# EAGLE design rpi-shield (EAGLE 9.2.2)
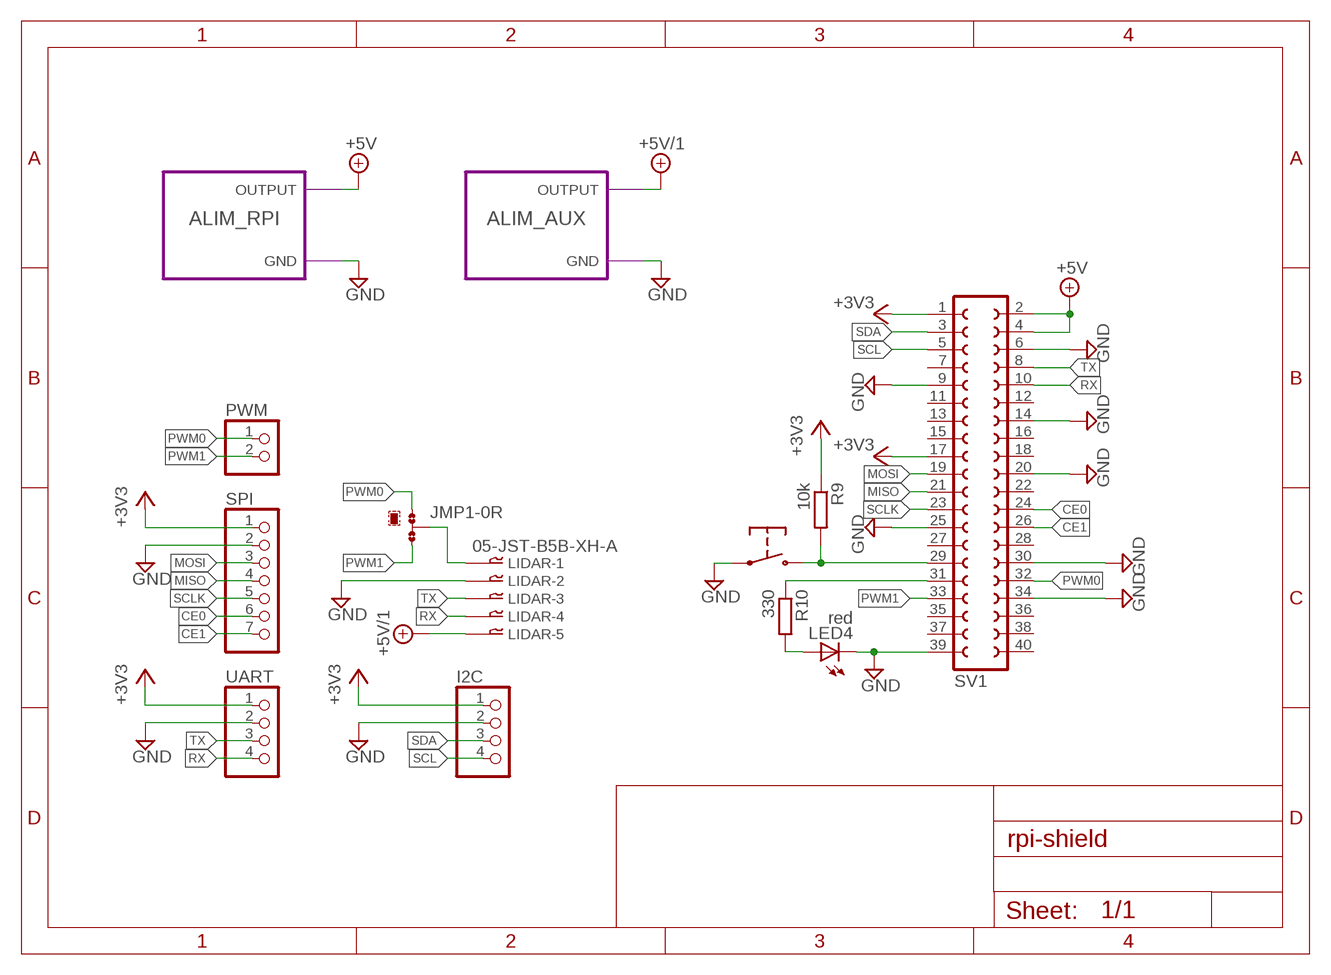
[diagram p0: schematic, sheet 1]

## Parts
I2C  PINHD-1X4  [1X04]
JMP1  0R-JUMPA  [A0R-JMP]
LED4  red  LEDSMT1206  [1206]
LIDAR  05-JST-B5B-XH-A  [B5B-XH]
PWM  PINHD-1X2  [1X02]
R9  10k  R-EU_R0805  [R0805]
R10  330  R-EU_R0805  [R0805]
SPI  PINHD-1X7  [1X07]
SV1  FE20-2  [FE20-2]
U$2  PUSH-BUTTON  [PUSH-BUTTON]
UART  PINHD-1X4  [1X04]

## Module instances
ALIM_RPI = 5V_ALIM
ALIM_AUX = 5V_ALIM

## Nets
+3V3: I2C.1 R9.1 SPI.1 SV1.1 SV1.17 UART.1
+5V: SV1.2 SV1.4 ; port ALIM_RPI.OUTPUT
+5V/1: LIDAR.P$5 ; port ALIM_AUX.OUTPUT
CE0: SPI.6 SV1.24
CE1: SPI.7 SV1.26
GND: I2C.2 LED4.C LIDAR.P$2 SPI.2 SV1.6 SV1.9 SV1.14 SV1.20 SV1.25 SV1.30 SV1.34 SV1.39 U$2.1 U$2.2 UART.2 ; port ALIM_RPI.GND ALIM_AUX.GND
MISO: SPI.4 SV1.21
MOSI: SPI.3 SV1.19
N$1: JMP1.2 LIDAR.P$1
N$2: R9.2 SV1.29 U$2.3 U$2.4
N$5: R10.1 SV1.31
N$11: LED4.A R10.2
PWM0: JMP1.1 PWM.1 SV1.32
PWM1: JMP1.3 PWM.2 SV1.33
RX: LIDAR.P$4 SV1.10 UART.4
SCL: I2C.4 SV1.5
SCLK: SPI.5 SV1.23
SDA: I2C.3 SV1.3
TX: LIDAR.P$3 SV1.8 UART.3
Unconnected: SV1.7 SV1.11 SV1.12 SV1.13 SV1.15 SV1.16 SV1.18 SV1.22 SV1.27 SV1.28 SV1.35 SV1.36 SV1.37 SV1.38 SV1.40

## Library data of the parts
I2C UART = pinhead:PINHD-1X4: PIN HEADER
JMP1 = jump-0r-smd:0R-JUMP: SMD 0R 0805 Jumper
LED4 = led:LED: LED OSRAM: - CHIPLED LG R971, LG N971, LY N971, LG Q971, LY Q971, LO R971, LY R971 LH N974, LH R974 LS Q976, LO Q976, LY Q976 LO Q996 - Hyper CHIPLED LW Q18S LB Q993, LB Q99A, LB R99A - SideLED LS A670, LO A670, LY A670, LG A670, LP A670 LB A673, LV A673, LT A673, LW A673 LH A674 LY A675 LS A676, LA A676, LO A676, LY A676, LW A676 LS A679, LY A679, LG A679 - Hyper Micro SIDELED® LS Y876, LA Y876, LO Y876, LY Y876 LT Y87S - SmartLED LW L88C, LW L88S LB L89C, LB L89S, LG L890 LS L89K, LO L89K, LY L89K LS L896, LA L896, LO L896, LY L896 - TOPLED LS T670, LO T670, LY T670, LG T670, LP T670 LSG T670, LSP T670, LSY T670, LOP T670, LYG T670 LG T671, LOG T671, LSG T671 LB T673, LV T673, LT T673, LW T673 LH T674 LS T676, LA T676, LO T676, LY T676, LB T676, LH T676, LSB T676, LW T676 LB T67C, LV T67C, LT T67C, LS T67K, LO T67K, LY T67K, LW E67C LS E67B, LA E67B, LO E67B, LY E67B, LB E67C, LV E67C, LT E67C LW T67C LS T679, LY T679, LG T679 LS T770, LO T770, LY T770, LG T770, LP T770 LB T773, LV T773, LT T773, LW T773 LH T774 LS E675, LA E675, LY E675, LS T675 LS T776, LA T776, LO T776, LY T776, LB T776 LHGB T686 LT T68C, LB T68C - Hyper Mini TOPLED® LB M676 - Mini TOPLED Santana® LG M470 LS M47K, LO M47K, LY M47K Source: http://www.osram.convergy.de LUXEON: - LUMILED® LXK2-PW12-R00, LXK2-PW12-S00, LXK2-PW14-U00, LXK2-PW14-V00 LXK2-PM12-R00, LXK2-PM12-S00, LXK2-PM14-U00 LXK2-PE12-Q00, LXK2-PE12-R00, LXK2-PE12-S00, LXK2-PE14-T00, LXK2-PE14-U00 LXK2-PB12-K00, LXK2-PB12-L00, LXK2-PB12-M00, LXK2-PB14-N00, LXK2-PB14-P00, LXK2-PB14-Q00 LXK2-PR12-L00, LXK2-PR12-M00, LXK2-PR14-Q00, LXK2-PR14-R00 LXK2-PD12-Q00, LXK2-PD12-R00, LXK2-PD12-S00 LXK2-PH12-R00, LXK2-PH12-S00 LXK2-PL12-P00, LXK2-PL12-Q00, LXK2-PL12-R00 Source: www.luxeon.com KINGBRIGHT: KA-3528ASYC Source: www.kingbright.com
LIDAR = bt_con-jst-xh:05-JST: JST CONNECTOR
PWM = pinhead:PINHD-1X2: PIN HEADER
R9 R10 = resistor:R-EU_: RESISTOR, European symbol
SPI = pinhead:PINHD-1X7: PIN HEADER
SV1 = con-lsta:FE20-2: FEMALE HEADER; OC_FARNELL: unknown; OC_NEWARK: unknown
U$2 = push-button:PUSH-BUTTON; RS: 479-1491

## Module 5V_ALIM
Ports: OUTPUT(io) GND(io)
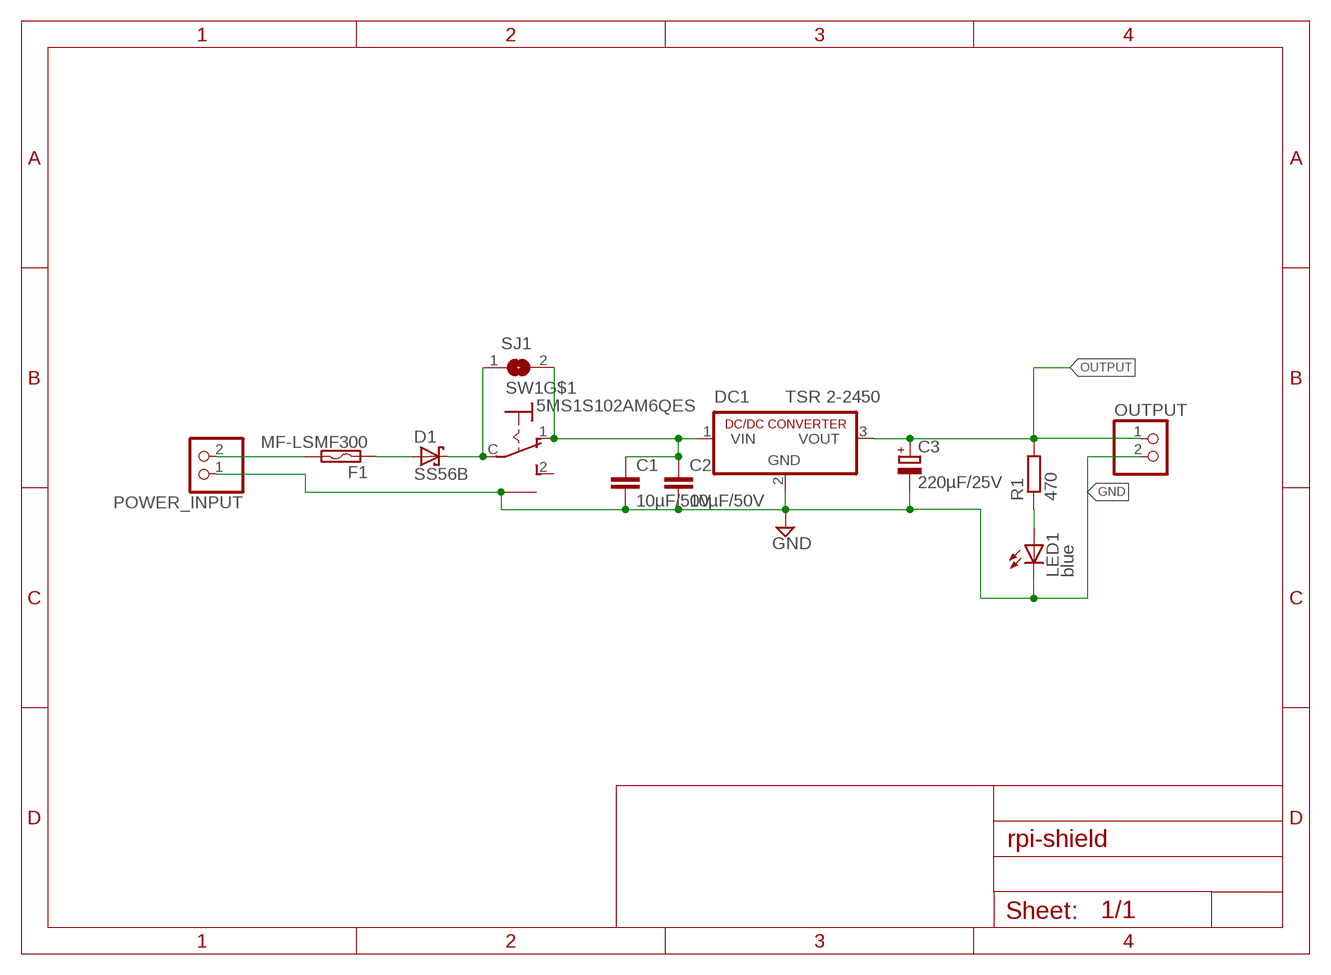
[diagram p1: schematic, module 5V_ALIM, sheet 1]

### Parts
C1  10µF/50V  C-EUC1210  [C1210]
C2  10µF/50V  C-EUC1210  [C1210]
C3  220µF/25V  CPOL-EUE3.5-8  [E3,5-8]
D1  SS56B  SCHOTTKY-DIODESMD  [SMB]
DC1  TSR 2-2450  R-78C5.0-1.0  [SIP3]
F1  MF-LSMF300  [MF-LSMF300]
LED1  blue  LEDSMT1206  [1206]
OUTPUT  PINHD-1X2  [1X02]
POWER_INPUT  PINHD-1X2  [1X02]
R1  470  R-EU_R0805  [R0805]
SJ1  SJ  [SJ]
SW1  5MS1S102AM6QES  [SPDT_SLIDE_SWITCH]

### Nets
GND: C1.2 C2.2 C3.- DC1.2(GND) LED1.C OUTPUT.2 POWER_INPUT.1 SW1.P$4(GND) SW1.P$5(GND)
N$1 [1A]: C1.1 C2.1 DC1.1(VIN) SJ1.2 SW1.1
N$3: LED1.A R1.1
N$4 [1A]: D1.C SJ1.1 SW1.C
N$6: D1.A F1.1
N$7: F1.2 POWER_INPUT.2
OUTPUT [2A]: C3.+ DC1.3(VOUT) OUTPUT.1 R1.2
Unconnected: SW1.2

### Library data of the parts
C1 C2 = resistor:C-EU: CAPACITOR, European symbol
C3 = resistor:CPOL-EU: POLARIZED CAPACITOR, European symbol
D1 = diode:SCHOTTKY-DIODE: Schottky Diode; RS: 917-9221
DC1 = dc-dc-converter:R-78C*-1.0: INNOLINE DC/DC-Converter 1.0 AMP SIP3 Single Output Source: Data sheet <http://www.mikrocontroller.net/attachment/150645/157764-da-01-en-DC_DC_WANDLER_R_78C5_0_1_0.pdf>; RS: 906-8487
F1 = polyswitch:MF-LSMF300: PolySwitch (TM) Resettable Device Source: Data sheet <http://www.farnell.com/datasheets/13482.pdf>; RS: 817-1652
LED1 = led:LED: LED OSRAM: - CHIPLED LG R971, LG N971, LY N971, LG Q971, LY Q971, LO R971, LY R971 LH N974, LH R974 LS Q976, LO Q976, LY Q976 LO Q996 - Hyper CHIPLED LW Q18S LB Q993, LB Q99A, LB R99A - SideLED LS A670, LO A670, LY A670, LG A670, LP A670 LB A673, LV A673, LT A673, LW A673 LH A674 LY A675 LS A676, LA A676, LO A676, LY A676, LW A676 LS A679, LY A679, LG A679 - Hyper Micro SIDELED® LS Y876, LA Y876, LO Y876, LY Y876 LT Y87S - SmartLED LW L88C, LW L88S LB L89C, LB L89S, LG L890 LS L89K, LO L89K, LY L89K LS L896, LA L896, LO L896, LY L896 - TOPLED LS T670, LO T670, LY T670, LG T670, LP T670 LSG T670, LSP T670, LSY T670, LOP T670, LYG T670 LG T671, LOG T671, LSG T671 LB T673, LV T673, LT T673, LW T673 LH T674 LS T676, LA T676, LO T676, LY T676, LB T676, LH T676, LSB T676, LW T676 LB T67C, LV T67C, LT T67C, LS T67K, LO T67K, LY T67K, LW E67C LS E67B, LA E67B, LO E67B, LY E67B, LB E67C, LV E67C, LT E67C LW T67C LS T679, LY T679, LG T679 LS T770, LO T770, LY T770, LG T770, LP T770 LB T773, LV T773, LT T773, LW T773 LH T774 LS E675, LA E675, LY E675, LS T675 LS T776, LA T776, LO T776, LY T776, LB T776 LHGB T686 LT T68C, LB T68C - Hyper Mini TOPLED® LB M676 - Mini TOPLED Santana® LG M470 LS M47K, LO M47K, LY M47K Source: http://www.osram.convergy.de LUXEON: - LUMILED® LXK2-PW12-R00, LXK2-PW12-S00, LXK2-PW14-U00, LXK2-PW14-V00 LXK2-PM12-R00, LXK2-PM12-S00, LXK2-PM14-U00 LXK2-PE12-Q00, LXK2-PE12-R00, LXK2-PE12-S00, LXK2-PE14-T00, LXK2-PE14-U00 LXK2-PB12-K00, LXK2-PB12-L00, LXK2-PB12-M00, LXK2-PB14-N00, LXK2-PB14-P00, LXK2-PB14-Q00 LXK2-PR12-L00, LXK2-PR12-M00, LXK2-PR14-Q00, LXK2-PR14-R00 LXK2-PD12-Q00, LXK2-PD12-R00, LXK2-PD12-S00 LXK2-PH12-R00, LXK2-PH12-S00 LXK2-PL12-P00, LXK2-PL12-Q00, LXK2-PL12-R00 Source: www.luxeon.com KINGBRIGHT: KA-3528ASYC Source: www.kingbright.com
OUTPUT POWER_INPUT = pinhead:PINHD-1X2: PIN HEADER
R1 = resistor:R-EU_: RESISTOR, European symbol
SJ1 = jumper:SJ: SMD solder JUMPER
SW1 = switch:5MS1S102AM6QES; PARTNO: *; REF-FAB: 5MS1S102AM6QES; REF-RS: 734-7296

## Net classes
1 5A: width 2.8 mm, drill 0.5 mm
2 2A: width 0.8 mm, drill 0.4 mm
3 1A: width 0.3 mm, drill 0.35 mm

## Board
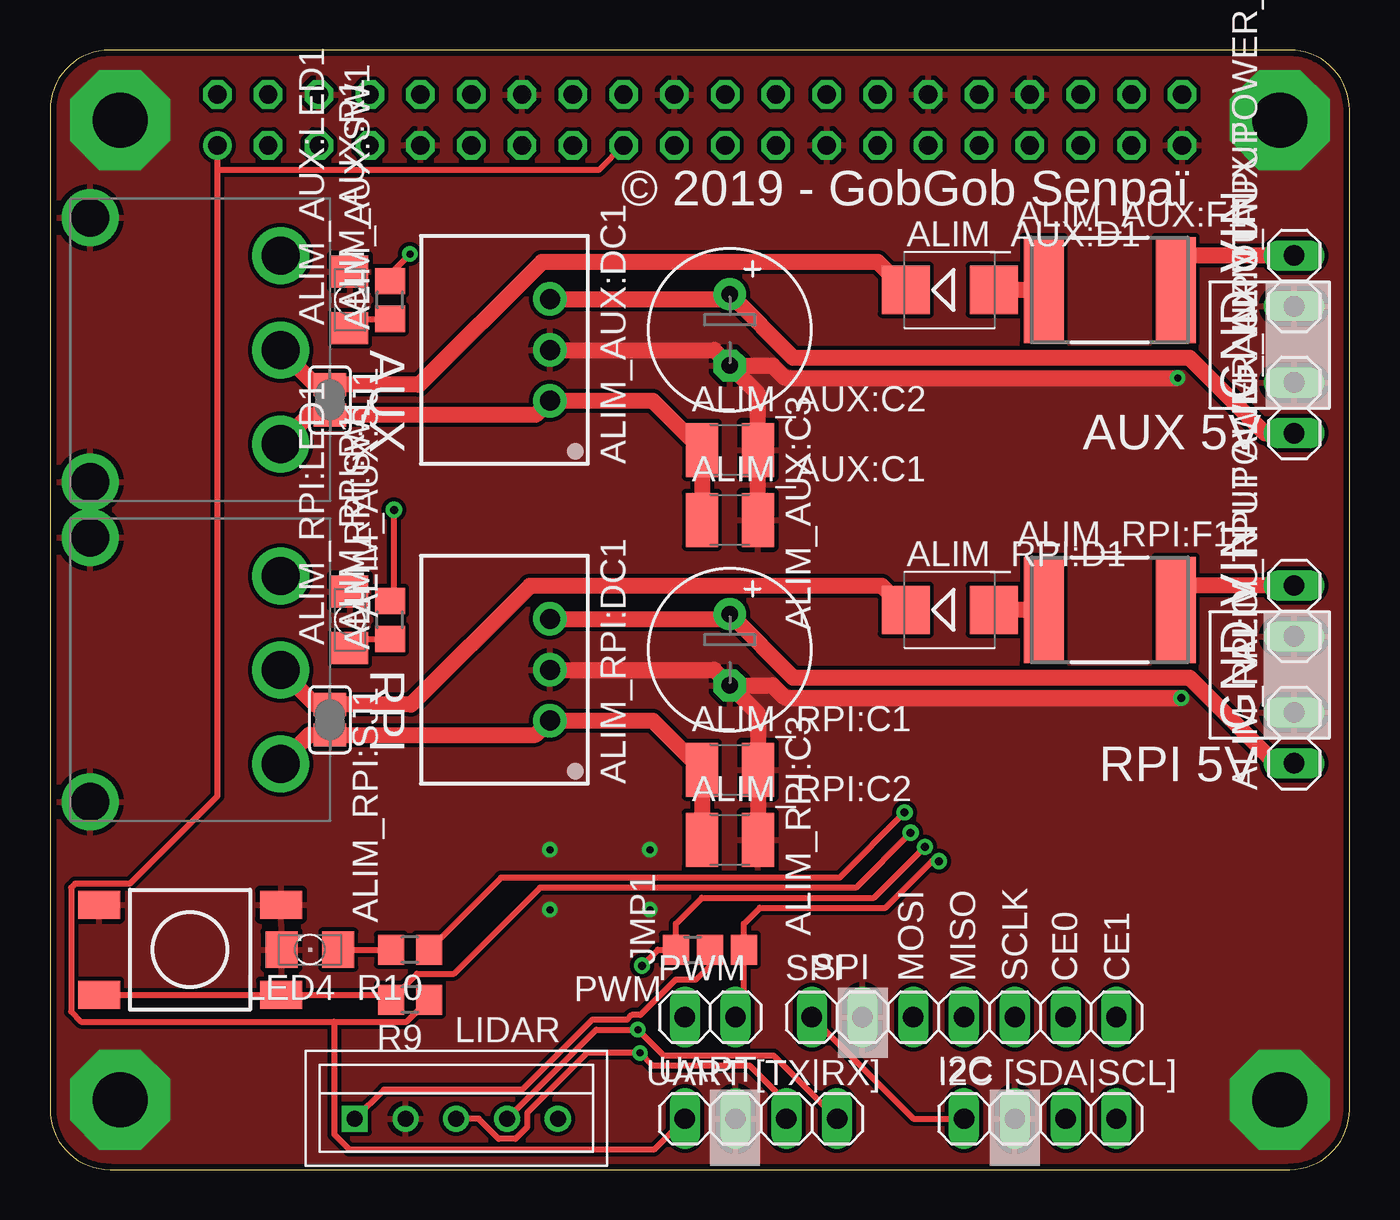
[diagram p2: board, top side]
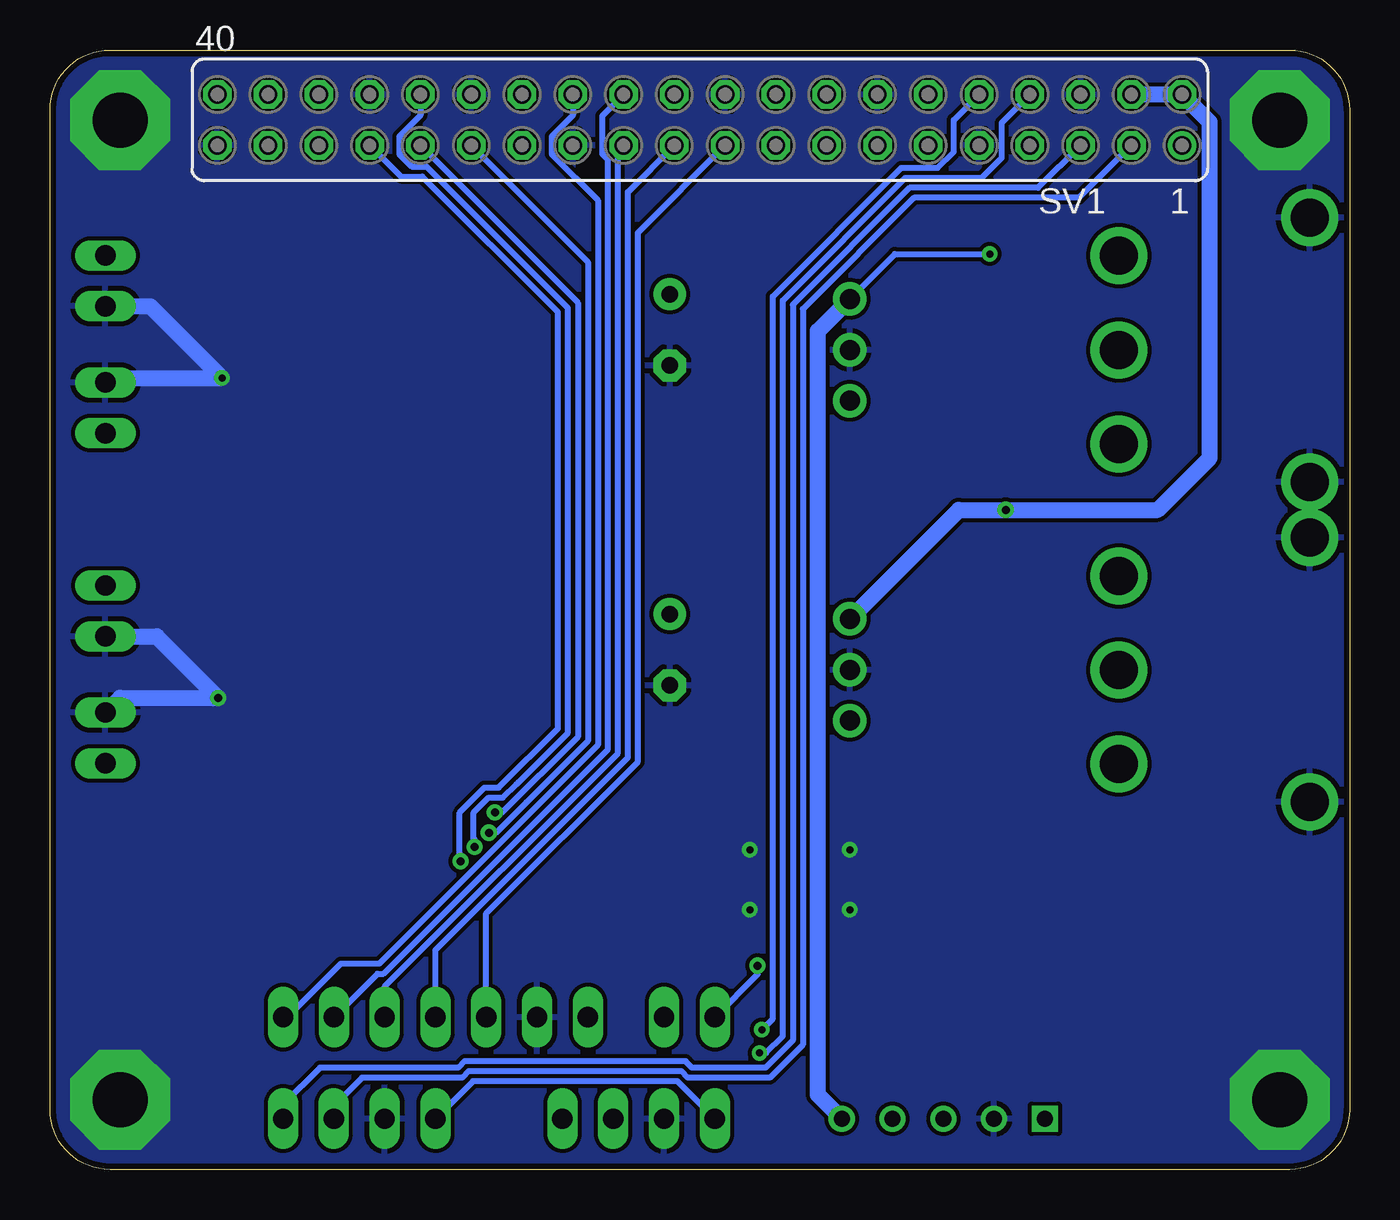
[diagram p3: board, bottom side, seen from below]

Size 65 x 56 mm. Coordinates in mm from the lower left corner, seen from the top.
Outline: 0,53 0,3 arc90 3,0 62,0 arc90 65,3 65,53 arc90 62,56 3,56 arc90 0,53
Copper layers (1*16): Top 0.035mm / dielectric 1.5mm / Bottom 0.035mm
Design rules "default *": minimum track width 0.2mm, minimum drill 0.35mm, track to track 0.2mm, track to pad 0.2mm, pad to pad 0.2mm, via to via 0.2mm, smd to smd 0.2mm, copper to edge 0.3mm, drill to drill 0.2mm, minimum pad ring 10mil, minimum via ring 8mil, stop-mask expansion 4mil, vias tented up to drill 0.8mm, thermal gap 10mil

### Footprints (pad centres in the part's own frame; a part is rotated, then mirrored left to right if it is on the bottom)
C1210 = smd 1.6 x 2.7: 1 -1.4,0; 2 1.4,0
E3,5-8 = drill 0.813 pad 1.6: + -1.778,0 | drill 0.813 pad 1.6 octagon: - 1.778,0
SMB = smd 2.4 x 2.4: A 2.2,0; C -2.2,0
SIP3 = drill 1 pad 1.676: 1 -2.54,0; 2 0,0; 3 2.54,0
MF-LSMF300 = smd 2 x 5.3: 1 -3.3,0; 2 3.3,0
1206 = smd 1.6 x 1.803: A -1.422,0; C 1.422,0
1X02 = drill 1.016 long: 1 -1.27,0; 2 1.27,0
R0805 = smd 1.3 x 1.5: 1 -0.95,0; 2 0.95,0
SJ = smd 1.168 x 1.6: 1 -0.762,0; 2 0.762,0
SPDT_SLIDE_SWITCH = drill 1.9: 1 -4.7,-9.53; 2 4.7,-9.53; C 0,-9.53; P$4 -6.605,0; P$5 6.605,0
1X04 = drill 1.016 long: 1 -3.81,0; 2 -1.27,0; 3 1.27,0; 4 3.81,0
A0R-JMP = smd 1.5 x 1.3: 1 0,1.7; 2 0,0; 3 0,-1.7
B5B-XH = drill 0.8 square: P$1 -5.08,0 | drill 0.8: P$2 -2.54,0; P$3 0,0; P$4 2.54,0; P$5 5.08,0
1X07 = drill 1.016 long: 1 -7.62,0; 2 -5.08,0; 3 -2.54,0; 4 0,0; 5 2.54,0; 6 5.08,0; 7 7.62,0
FE20-2 = drill 0.914: 1 -24.13,1.27 | drill 0.914 octagon: 2 -24.13,-1.27; 3 -21.59,1.27; 4 -21.59,-1.27; 5 -19.05,1.27; 6 -19.05,-1.27; 7 -16.51,1.27; 8 -16.51,-1.27; 9 -13.97,1.27; 10 -13.97,-1.27; 11 -11.43,1.27; 12 -11.43,-1.27; 13 -8.89,1.27; 14 -8.89,-1.27; 15 -6.35,1.27; 16 -6.35,-1.27; 17 -3.81,1.27; 18 -3.81,-1.27; 19 -1.27,1.27; 20 -1.27,-1.27; 21 1.27,1.27; 22 1.27,-1.27; 23 3.81,1.27; 24 3.81,-1.27; 25 6.35,1.27; 26 6.35,-1.27; 27 8.89,1.27; 28 8.89,-1.27; 29 11.43,1.27; 30 11.43,-1.27; 31 13.97,1.27; 32 13.97,-1.27; 33 16.51,1.27; 34 16.51,-1.27; 35 19.05,1.27; 36 19.05,-1.27; 37 21.59,1.27; 38 21.59,-1.27; 39 24.13,1.27; 40 24.13,-1.27
PUSH-BUTTON = smd 1.4 x 2.1: 1 2.25,4.55; 2 2.25,-4.55; 3 -2.25,4.55; 4 -2.25,-4.55

### Placement (x,y rotation side)
ALIM_AUX:C1  10µF/50V  [C1210]  34,32.5 0 top
ALIM_AUX:C2  10µF/50V  [C1210]  34,36 0 top
ALIM_AUX:C3  220µF/25V  [E3,5-8]  34,42 270 top
ALIM_AUX:D1  SS56B  [SMB]  45,44 0 top
ALIM_AUX:DC1  TSR 2-2450  [SIP3]  25,41 90 top
ALIM_AUX:F1  MF-LSMF300  [MF-LSMF300]  53,44 0 top
ALIM_AUX:LED1  blue  [1206]  15,43.5 90 top
ALIM_AUX:OUTPUT  [1X02]  62.23,38.1 90 top
ALIM_AUX:POWER_INPUT  [1X02]  62.23,44.45 90 top
ALIM_AUX:R1  470  [R0805]  17,43.5 90 top
ALIM_AUX:SJ1  [SJ]  14,38.5 270 top
ALIM_AUX:SW1  5MS1S102AM6QES  [SPDT_SLIDE_SWITCH]  2,41 90 top
ALIM_RPI:C1  10µF/50V  [C1210]  34,20 0 top
ALIM_RPI:C2  10µF/50V  [C1210]  34,16.5 0 top
ALIM_RPI:C3  220µF/25V  [E3,5-8]  34,26 270 top
ALIM_RPI:D1  SS56B  [SMB]  45,28 0 top
ALIM_RPI:DC1  TSR 2-2450  [SIP3]  25,25 90 top
ALIM_RPI:F1  MF-LSMF300  [MF-LSMF300]  53,28 0 top
ALIM_RPI:LED1  blue  [1206]  15,27.5 90 top
ALIM_RPI:OUTPUT  [1X02]  62.23,21.59 90 top
ALIM_RPI:POWER_INPUT  [1X02]  62.23,27.94 90 top
ALIM_RPI:R1  470  [R0805]  17,27.5 90 top
ALIM_RPI:SJ1  [SJ]  14,22.5 270 top
ALIM_RPI:SW1  5MS1S102AM6QES  [SPDT_SLIDE_SWITCH]  2,25 90 top
I2C  49.53,2.54 0 top
JMP1  33,11 90 top
LED4  13,11 180 top
LIDAR  20.32,2.54 0 top
PWM  33.02,7.62 0 top
R9  18,8.5 180 top
R10  18,11 180 top
SPI  45.72,7.62 0 top
SV1  32.5,52.5 180 bottom
U$2  7,11 90 top
UART  35.56,2.54 0 top

### Tracks (layer width: path | path; a pad name or v marks a point on that pad's centre or on a via)
+3V3
  Top 0.3: SPI.1 43.18,2.54 I2C.1 | UART.1 30.21,1 14.98,1 14.24,1.74 14.24,7.36 14.2,7.4 | SV1.1 8.37,50 | 8.37,50 8.37,18.68 4,14.3 1.25,14.3 1.05,14.1 1.05,7.91 1.55,7.4 14.2,7.4 | SV1.17 27.46,50 8.37,50 | R9.1 17.84,7.4 14.2,7.4
  Bottom 0.3: UART.1 33.62,4.41 43.85,4.41 I2C.1
+5V  (via drill 0.4)
  Top 0.3: ALIM_RPI:R1.2 17.2,28.65 v17.2,33
  Top 0.8: ALIM_RPI:DC1.3 33.76,27.54 ALIM_RPI:C3.+ 37.18,24.6 57,24.6 61.28,20.32 ALIM_RPI:OUTPUT.1
  Bottom 0.8: ALIM_RPI:DC1.3 19.54,33 v17.2,33 9.6,33 7,35.6 7,52.4 SV1.2 SV1.4
+5V/1  (via drill 0.35)
  Top 0.3: v18,45.8 17,44.8 ALIM_AUX:R1.2
  Top 0.8: ALIM_AUX:DC1.3 33.76,43.54 ALIM_AUX:C3.+ 37.18,40.6 57,40.6 60.77,36.83 ALIM_AUX:OUTPUT.1
  Bottom 0.3: ALIM_AUX:DC1.3 22.74,45.8 v18,45.8
  Bottom 0.8: LIDAR.P$5 26.6,3.74 26.6,41.94 ALIM_AUX:DC1.3
ALIM_AUX:N$1
  Top 0.8: ALIM_AUX:SW1.1 12.97,37.74 ALIM_AUX:SJ1.2 24.28,37.74 ALIM_AUX:DC1.1 30.14,38.46 ALIM_AUX:C2.1 ALIM_AUX:C1.1
ALIM_AUX:N$3
  Top 0.3: ALIM_AUX:LED1.A 15.47,42.55 ALIM_AUX:R1.1
ALIM_AUX:N$4
  Top 0.8: ALIM_AUX:D1.C 41.4,45.4 24.6,45.4 18.46,39.26 ALIM_AUX:SJ1.1 13.27,39.26 ALIM_AUX:SW1.C
ALIM_AUX:N$6
  Top 0.8: ALIM_AUX:F1.1 ALIM_AUX:D1.A
ALIM_AUX:N$7
  Top 0.8: ALIM_AUX:POWER_INPUT.2 57.12,45.72 56.3,44.9 ALIM_AUX:F1.2
ALIM_RPI:N$1
  Top 0.8: ALIM_RPI:SW1.1 12.97,21.74 ALIM_RPI:SJ1.2 24.28,21.74 ALIM_RPI:DC1.1 30.14,22.46 ALIM_RPI:C1.1 ALIM_RPI:C2.1
ALIM_RPI:N$3
  Top 0.3: ALIM_RPI:LED1.A 15.47,26.55 ALIM_RPI:R1.1
ALIM_RPI:N$4
  Top 0.8: ALIM_RPI:D1.C 41.6,29.2 24,29.2 18.06,23.26 ALIM_RPI:SJ1.1 13.27,23.26 ALIM_RPI:SW1.C
ALIM_RPI:N$6
  Top 0.8: ALIM_RPI:F1.1 ALIM_RPI:D1.A
ALIM_RPI:N$7
  Top 0.8: ALIM_RPI:POWER_INPUT.2 57.01,29.21 56.3,28.5 ALIM_RPI:F1.2
CE0
  Bottom 0.3: SPI.6 48.62,9.8 48.32,9.8 37.1,21.02 37.1,50.52 37.37,50.79 37.37,52.71 SV1.24
CE1
  Bottom 0.3: SV1.26 38.85,52.73 39.91,51.67 39.91,50.79 37.6,48.48 37.6,21.23 48.53,10.3 50.45,10.3 53.13,7.62 SPI.7
GND  (via drill 0.35, 0.4, 2.75 pad 5)
  Top 0.8: ALIM_AUX:DC1.2 33.22,41 ALIM_AUX:C3.- | ALIM_AUX:C1.2 ALIM_AUX:C2.2 35.4,38.82 ALIM_AUX:C3.- | ALIM_AUX:C3.- 36.14,40.22 36.76,39.6 v56.4,39.6 | ALIM_RPI:DC1.2 33.22,25 ALIM_RPI:C3.- | ALIM_RPI:C3.- 35.4,22.82 ALIM_RPI:C1.2 ALIM_RPI:C2.2 | ALIM_RPI:C3.- 36.14,24.22 36.76,23.6 v56.59,23.6
  Bottom 0.8: ALIM_AUX:POWER_INPUT.1 59.98,43.18 v56.4,39.6 62,39.6 ALIM_AUX:OUTPUT.2 | ALIM_RPI:POWER_INPUT.1 59.66,26.67 v56.58,23.6 61.49,23.6 ALIM_RPI:OUTPUT.2
  other vias: 25,13 30,13 30,16 25,16 3.5,52.5 61.5,52.5 61.5,3.5 3.5,3.5
  pour Top: 0,56 65,56 65,0 0,0
  pour Bottom: 0,56 65,56 65,0 0,0
MISO
  Bottom 0.3: SPI.4 45.72,10.99 36.1,20.61 36.1,48.9 SV1.21
MOSI
  Bottom 0.3: SPI.3 43.18,12.82 35.6,20.4 35.6,46.86 SV1.19
N$1
  Top 0.3: LIDAR.P$1 16.7,4 23.61,4 27.11,7.5 28.87,7.5 29.1,7.73 29.53,7.73 30.64,8.84 31.29,9.49 32.29,9.49 33,10.2 JMP1.2
N$2  (via drill 0.4)
  Top 0.3: U$2.3 U$2.4 16.8,8.75 R9.2 18.35,9.8 20.2,9.8 24.5,14.1 40.3,14.1 v43.05,16.85
  Bottom 0.3: SV1.29 38.1,45.4 38.1,21.44 41.17,18.37 42.69,16.85 v43.05,16.85
N$5  (via drill 0.4)
  Top 0.3: R10.1 22.55,14.6 39.49,14.6 v42.75,17.85
  Bottom 0.3: SV1.31 38.6,43.36 38.6,21.64 42.39,17.85 v42.75,17.85
N$11
  Top 0.3: LED4.A R10.2
PWM0  (via drill 0.4)
  Top 0.3: v29.6,10.2 30.4,11 JMP1.1 31.3,12.3 32.6,13.6 41.22,13.6 v43.76,16.14
  Bottom 0.3: SV1.32 46.47,52.73 47.53,51.67 47.53,50.79 46.91,50.17 46.17,50.17 39.1,43.1 39.1,21.85 41.58,19.38 41.67,19.27 42.34,18.61 43.06,18.61 43.8,17.87 43.8,16.54 43.76,16.49 v43.76,16.14 | PWM.1 29.6,9.77 v29.6,10.2
PWM1  (via drill 0.4)
  Top 0.3: PWM.2 34.7,8.03 JMP1.3 34.7,12.3 35.5,13.1 41.79,13.1 44.11,15.42 v44.47,15.42
  Bottom 0.3: SV1.33 47.45,49.67 46.38,49.67 39.6,42.89 39.6,22.06 42.55,19.11 43.27,19.11 44.51,17.86 44.51,15.82 44.47,15.78 v44.47,15.42
RX  (via drill 0.35)
  Top 0.3: UART.4 36.21,5.7 30.7,5.7 v29.4,7 27.32,7 LIDAR.P$4
  Bottom 0.3: v29.4,7 28.85,7.55 28.85,43.67 22.42,50.1 20.6,50.1 19.8,50.9 19.8,52.5 SV1.10
SCL
  Bottom 0.3: I2C.4 53.34,3.26 51.5,5.1 44.57,5.1 44.26,5.41 33.21,5.41 32.9,5.1 29.21,5.1 27.85,6.46 27.85,43.26 22.01,49.1 15.58,49.1 SV1.5
SCLK
  Bottom 0.3: SPI.5 48.26,9.15 36.6,20.81 36.6,50.94 SV1.23
SDA
  Bottom 0.3: I2C.3 50.8,3.2 49.4,4.6 44.37,4.6 44.05,4.91 33.42,4.91 33.1,4.6 29,4.6 27.35,6.25 27.35,43.05 21.8,48.6 13.54,48.6 SV1.3
TX  (via drill 0.35)
  Top 0.3: UART.3 36.83,3.37 35,5.2 30.14,5.2 v29.51,5.83 26.86,5.83 23.86,2.84 23.86,2.12 23.28,1.54 22.44,1.54 21.44,2.54 LIDAR.P$3
  Bottom 0.3: v29.51,5.83 29.19,5.83 28.35,6.66 28.35,43.46 22.21,49.6 18.4,49.6 17.4,50.6 17.4,52.36 SV1.8

### Text on the board
tPlace: © 2019 - GobGob Senpaï | VIN | GND | AUX | AUX 5V | VIN | GND | RPI | RPI 5V | SPI | MOSI | MISO | SCLK | CE0 | CE1 | PWM | UART [TX|RX] | I2C [SDA|SCL]